# EAGLE design ATTinyBreakout (EAGLE 7.2.0)
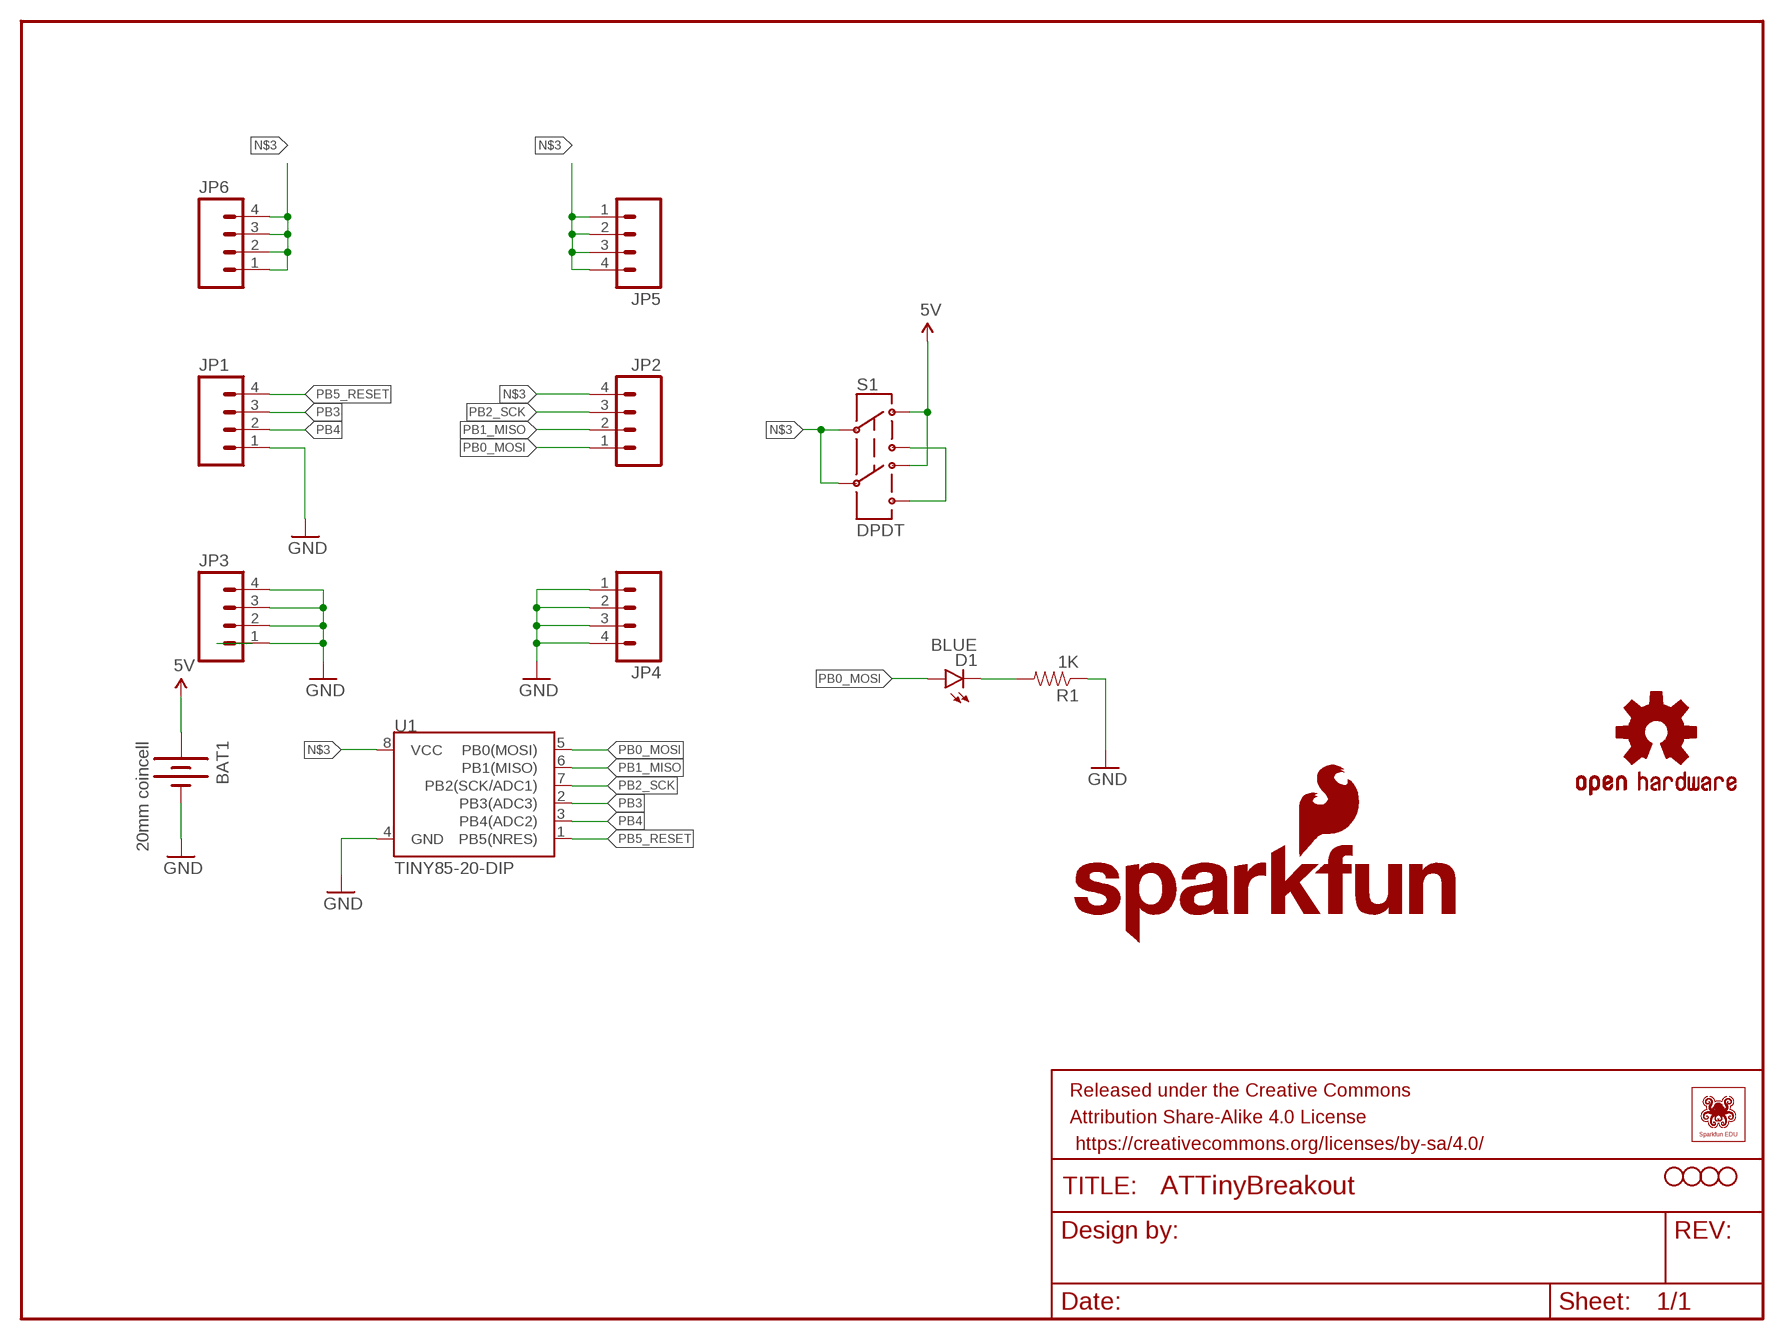
[diagram p0: schematic, sheet 1]

## Parts
BAT1  20mm coincell  BATTERY20MM_4LEGS  [BATTCON_20MM_4LEGS]
D1  BLUE  LED-BLUE1206  [LED-1206]
FRAME1  FRAME-LETTER  [CREATIVE_COMMONS]
JP1  M04LOCK  [1X04_LOCK]
JP2  M04LOCK  [1X04_LOCK]
JP3  M04LOCK  [1X04_LOCK]
JP4  M04LOCK  [1X04_LOCK]
JP5  M04LOCK  [1X04_LOCK]
JP6  M04LOCK  [1X04_LOCK]
LOGO2  SFE_LOGO_FLAME.1_INCH  [SFE_LOGO_FLAME_.1]
LOGO3  OSHW-LOGOS  [OSHW-LOGO-S]
LOGO4  SFE_LOGO_NAME_FLAME.1_INCH  [SFE_LOGO_NAME_FLAME_.1]
R1  1K  1KOHM-1/10W-1%(0603)  [0603-RES]
S1  DPDT  SWITCH-DPDTAYZ0202  [AYZ0202]
STANDOFF1  STAND-OFF  [STAND-OFF]
STANDOFF2  STAND-OFF  [STAND-OFF]
STANDOFF3  STAND-OFF  [STAND-OFF]
STANDOFF4  STAND-OFF  [STAND-OFF]
U1  TINY85-20-DIP  ATTINY45TINY85-20-DIP  [DIP08]
U$2  SFE_LUDUSSFE_LUDUS-M  [SFE_LUDUS-M]

## Nets
GND: BAT1.2(-) JP1.1 JP3.1 JP3.2 JP3.3 JP3.4 JP4.1 JP4.2 JP4.3 JP4.4 R1.1 U1.4(GND)
N$1: D1.C R1.2
N$2: S1.3 S1.6
N$3: JP2.4 JP5.1 JP5.2 JP5.3 JP5.4 JP6.1 JP6.2 JP6.3 JP6.4 S1.2 S1.5 U1.8(VCC)
PB0_MOSI: D1.A JP2.1 U1.5(PB0(MOSI))
PB1_MISO: JP2.2 U1.6(PB1(MISO))
PB2_SCK: JP2.3 U1.7(PB2(SCK/ADC1))
PB3: JP1.3 U1.2(PB3(ADC3))
PB4: JP1.2 U1.3(PB4(ADC2))
PB5_RESET: JP1.4 U1.1(PB5(NRES))
VCC: BAT1.1(+) S1.1 S1.4 ; supply symbol labelled 5V

## Library data of the parts
BAT1 = SparkFun-Electromechanical:BATTERY: Battery Holders Various common sizes : AA, AAA, 18650 (PRT-12895), 20mm coin cell and 12mm coin cell. 20MM_4LEGS, BATT-10373; PROD_ID: BATT-10373
D1 = SparkFun-LED:LED-BLUE: Blue LEDs for production use Various blue LEDs stocked by SparkFun production 0603 - DIO-08575 Rebel - DIO-09553 1206 - DIO-09911; PROD_ID: DIO-09911
FRAME1 = SparkFun-Aesthetics:FRAME-LETTER: Schematic Frame Standard 8.5x11 US Letter frame; DESIGNER: NAME; VERSION: v01
JP1-JP6 = SparkFun-Connectors:M04: Header 4 Standard 4-pin 0.1" header. Use with straight break away headers (SKU : PRT-00116), right angle break away headers (PRT-00553), swiss pins (PRT-00743), machine pins (PRT-00117), and female headers (PRT-00115). Molex polarized connector foot print use with SKU : PRT-08231 with associated crimp pins and housings. 1MM SMD Version SKU: PRT-10208
LOGO2 = SparkFun-Aesthetics:SFE_LOGO_FLAME: SFE Logo, flame only This is the SparkFun flame logo. The logo on the schematic will always be the same size; the package variant is the height of the flame. Default layer for the logo on the board is tSilk.
LOGO3 = SparkFun-Aesthetics:OSHW-LOGO: Open Source Hardware Logo This logo indicates the piece of hardware it is found on incorporates a OSHW license and/or adheres to the definition of open source hardware found here: http://freedomdefined.org/OSHW
LOGO4 = SparkFun-Aesthetics:SFE_LOGO_NAME_FLAME: SFE Logo, name and flame This is the SparkFun full logo. The logo on the schematic will always be the same size; the package variant is the height of the flame part of the logo. Default layer for the logo on the board is tSilk.
R1 = SparkFun-Resistors:1KOHM-1/10W-1%(0603): RES-07856; PROD_ID: RES-07856
S1 = SparkFun-Electromechanical:SWITCH-DPDT: DPDT Version of the COM-00597; PROD_ID: SWCH-08179
STANDOFF1-STANDOFF4 = SparkFun-Electromechanical:STAND-OFF: #4 Stand Off This is the mechanical footprint for a #4 phillips button head screw. Use the keepout ring to avoid running the screw head into surrounding components. SKU : PRT-00447
U1 = SparkFun-DigitalIC:ATTINY45: Atmel 8-pin 2/4/8kB flash uC; PROD_ID: IC-09445
U$2 = SparkFun-Aesthetics:SFE_LUDUS

## Board
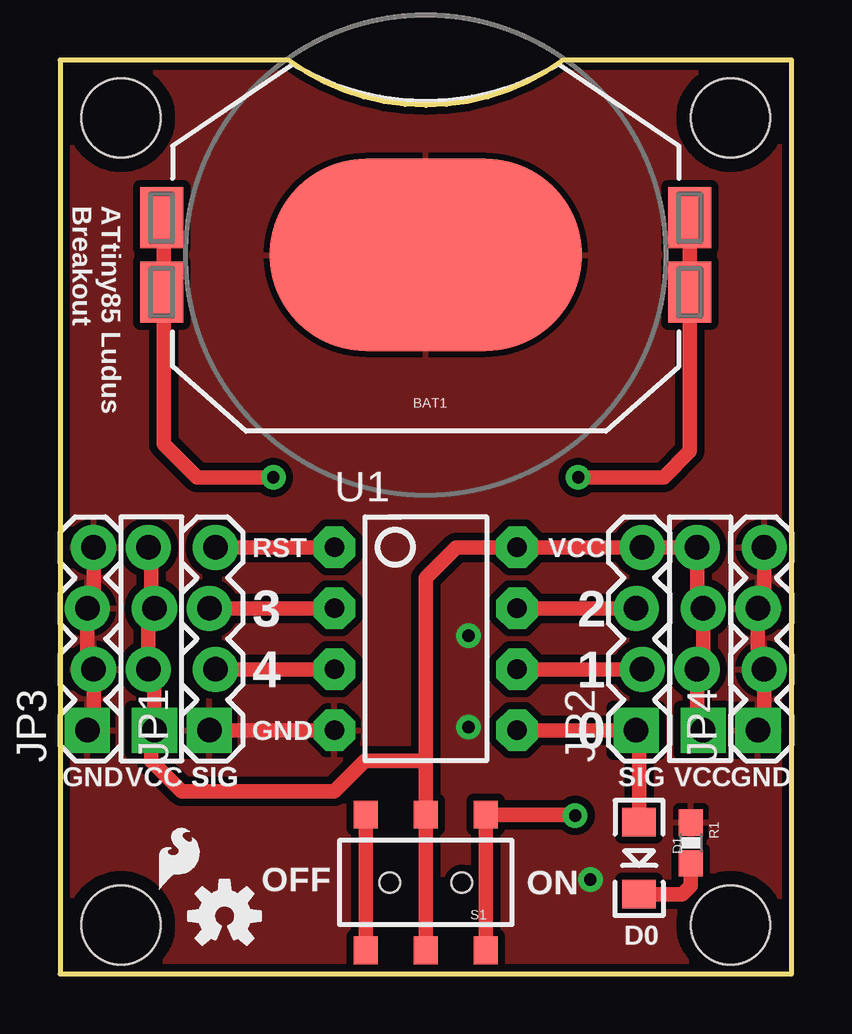
[diagram p1: board, top side]
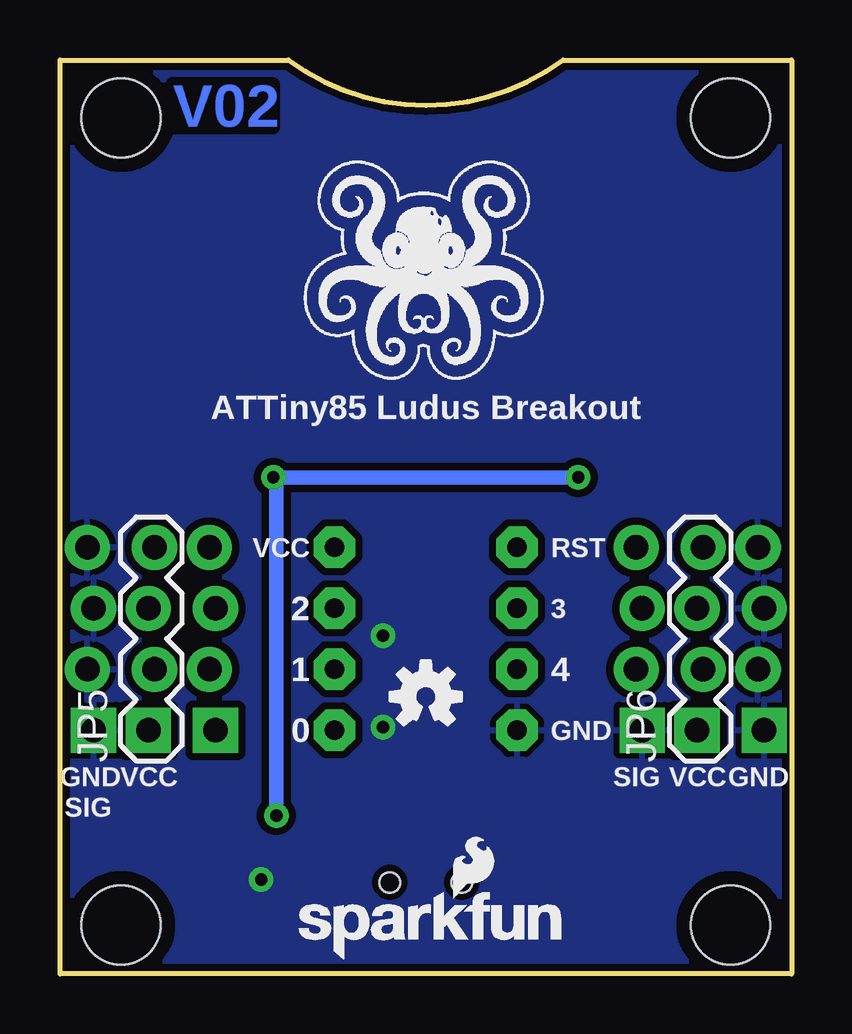
[diagram p2: board, bottom side, seen from below]

Size 30.48 x 38.1 mm. Coordinates in mm from the lower left corner, seen from the top.
Outline: 0,0 30.48,0 30.48,38.1 20.95,38.1 arc-73 9.53,38.1 0,38.1 0,0
Copper layers (1*16): Top 0.035mm / dielectric 1.5mm / Bottom 0.035mm
Design rules "SparkFun-2-layer": minimum track width 7mil, minimum drill 15mil, track to track 8mil, track to pad 8mil, pad to pad 8mil, via to via 8mil, smd to smd 8mil, copper to edge 8mil, drill to drill 8mil, minimum pad ring 12mil, minimum via ring 10mil, stop-mask expansion 4mil, vias tented up to drill 20mil, thermal gap 10mil

### Footprints (pad centres in the part's own frame; a part is rotated, then mirrored left to right if it is on the bottom)
BATTCON_20MM_4LEGS = smd 1.778 x 2.54: 1 -11,1.55; 3 11,1.55; P$1 -11,-1.55; P$2 11,-1.55 | smd 13 x 8: 2 0,0
LED-1206 = smd 1.2 x 1.4: A -1.5,0; C 1.5,0
1X04_LOCK = drill 1.016 pad 1.88 square: 1 0,0.127 | drill 1.016 pad 1.88: 2 2.54,-0.127; 3 5.08,0.127; 4 7.62,-0.127
0603-RES = smd 1.1 x 1: 1 -0.85,0; 2 0.85,0
AYZ0202 = smd 1 x 1.15: 1 -2.5,2.825; 2 0,2.825; 3 2.5,2.825; 4 -2.5,-2.825; 5 0,-2.825; 6 2.5,-2.825 | hole 0.85: 1.5,0; -1.5,0
STAND-OFF = hole 3.302: 0,0
DIP08 = drill 0.813 pad 1.727 octagon: 1 -3.81,-3.81; 2 -1.27,-3.81; 3 1.27,-3.81; 4 3.81,-3.81; 5 3.81,3.81; 6 1.27,3.81; 7 -1.27,3.81; 8 -3.81,3.81

### Placement (x,y rotation side)
BAT1  15.24,29.97 180 top
D1  24.13,4.83 270 top
FRAME1  10.16,-35.56 0 top  (outside the outline)
JP1  6.35,10.16 90 top
JP2  24.13,10.16 90 top
JP3  1.27,10.16 90 top
JP4  29.21,10.16 90 top
JP5  26.67,10.16 90 bottom
JP6  3.81,10.16 90 bottom
LOGO2  3.81,3.17 0 top
LOGO3  6.86,2.41 0 top
LOGO4  20.95,0.51 0 bottom
R1  26.29,5.46 270 top
S1  15.24,3.81 180 top
STANDOFF1  27.94,2.03 0 top
STANDOFF2  2.54,2.03 0 top
STANDOFF3  27.94,35.69 0 top
STANDOFF4  2.54,35.69 0 top
U1  15.24,13.97 270 top
U$1  OSHW-LOGOS  [OSHW-LOGO-S]  15.24,11.56 0 bottom
U$2  15.24,29.21 0 bottom

### Tracks (layer width: path | path; a pad name or v marks a point on that pad's centre or on a via)
GND  (via drill 0.51)
  Top 0.61: JP3.4 1.4,15.49 JP3.3 1.14,12.95 JP3.2 1.4,10.41 JP3.1 | JP4.4 29.34,15.37 29.21,15.24 JP4.3 29.08,12.95 JP4.2 29.34,10.41 JP4.1 | JP1.1 U1.4
  other vias: 22.1,3.94 17.02,14.1 17.02,10.29
  pour Bottom (isolate 0.305): 0,38.1 30.48,38.1 30.48,0 0,0
  pour Top (isolate 0.305): 0,0 30.48,0 30.48,38.1 0,38.1
N$1
  Top 0.61: D1.C 25.93,3.33 26.04,3.43 26.29,3.68 R1.2
N$2
  Top 0.61: S1.6 S1.3
N$3
  Top 0.61: S1.2 S1.5 15.24,8.89 | 15.24,8.89 15.24,16.51 16.51,17.78 U1.8 JP2.4 JP5.4 26.54,15.49 JP5.3 | 15.24,8.89 12.7,8.89 11.43,7.62 5.08,7.62 3.81,8.89 3.81,10.03 JP6.1 3.94,12.45 JP6.2 3.68,14.99 JP6.3 3.81,15.24 3.81,17.65 JP6.4 | 26.67,15.37 JP5.3 | JP5.3 26.8,12.95 JP5.2 26.54,10.41 JP5.1
PB0_MOSI
  Top 0.61: U1.5 JP2.1 24.13,10.03 D1.A
PB1_MISO
  Top 0.61: U1.6 JP2.2
PB2_SCK
  Top 0.61: U1.7 JP2.3
PB3
  Top 0.61: JP1.3 U1.2
PB4
  Top 0.61: U1.3 JP1.2
PB5_RESET
  Top 0.61: U1.1 JP1.4
VCC  (via drill 0.51)
  Top 0.406: 4.19,31.37 4.32,31.24 | 26.24,31.93 26.16,32 | 21.43,6.63 v21.46,6.6
  Top 0.61: 4.32,31.24 4.32,22.1 5.71,20.7 v8.89,20.7 | 26.24,31.93 BAT1.1 26.24,21.8 25.15,20.7 v21.59,20.7 | S1.1 S1.4 21.43,6.63
  Bottom 0.406: 21.46,20.57 v21.59,20.7
  Bottom 0.61: v21.46,6.6 21.46,20.57 | v8.89,20.7 v21.59,20.7

### Text on the board
Bottom: V02
tPlace: ATtiny85 Ludus / Breakout | RST | VCC | 3 | 2 | 4 | 1 | GND | 0 | GND | VCC | SIG | SIG | SIG | SIG | VCC | GND | OFF | ON | D0
bPlace: ATTiny85 Ludus Breakout | RST | VCC | 3 | 2 | 4 | 1 | GND | 0 | GND | VCC | SIG | VCC | GND | SIG
tDocu: Brian Huang